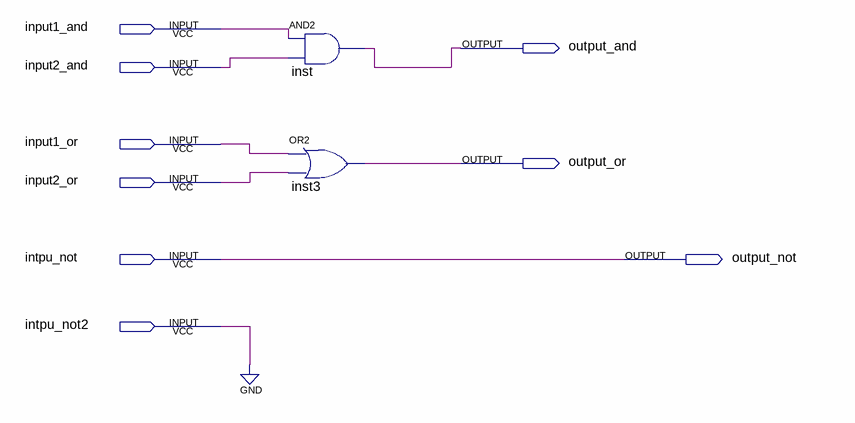
[diagram p0: schematic sheet]
// Quartus schematic Multivibrator.bdf as structural Verilog: 2 symbols, 9 pins
module Multivibrator (
  input  input1_and,
  input  input2_and,
  input  input1_or,
  input  input2_or,
  input  intpu_not,
  input  intpu_not2,
  output output_and,
  output output_or,
  output output_not
);

  and inst (output_and, input1_and, input2_and);
  or inst3 (output_or, input1_or, input2_or);

  assign output_not = intpu_not;
  // also tied to GND on the sheet: intpu_not2
endmodule
